# Altium project Cryo_DFFs.PrjPcb
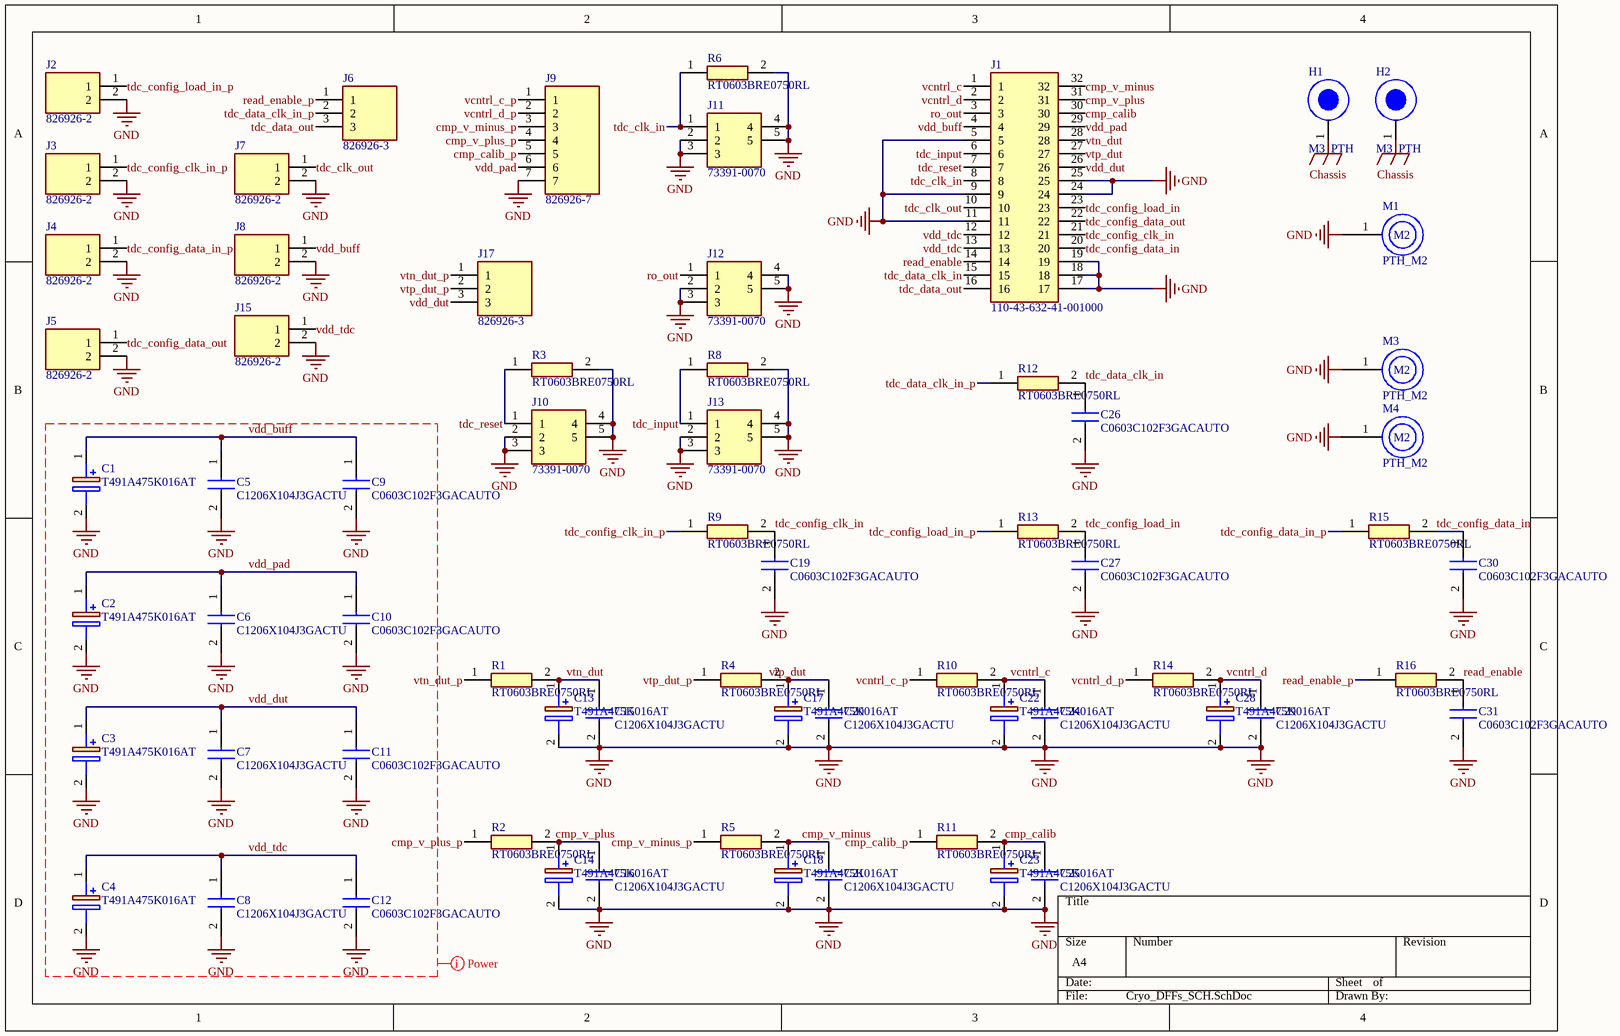
[diagram p0: Cryo_DFFs_SCH.SchDoc]
1 sheet, 66 parts. Net scope: global (net labels, ports and power ports of the same name join across sheets).
Board file: Cryo_DFFs_PCB.PcbDoc

## Sheet Cryo_DFFs_SCH.SchDoc
size A4; SheetNumber: 1; SheetTotal: 1

### Parts
C1  T491A475K016AT  [T491A]
C2  T491A475K016AT  [T491A]
C3  T491A475K016AT  [T491A]
C4  T491A475K016AT  [T491A]
C5  C1206X104J3GACTU  [C1206_FT]
C6  C1206X104J3GACTU  [C1206_FT]
C7  C1206X104J3GACTU  [C1206_FT]
C8  C1206X104J3GACTU  [C1206_FT]
C9  C0603C102F3GACAUTO  [C0603]
C10  C0603C102F3GACAUTO  [C0603]
C11  C0603C102F3GACAUTO  [C0603]
C12  C0603C102F3GACAUTO  [C0603]
C13  T491A475K016AT  [T491A]
C14  T491A475K016AT  [T491A]
C15  C1206X104J3GACTU  [C1206_FT]
C16  C1206X104J3GACTU  [C1206_FT]
C17  T491A475K016AT  [T491A]
C18  T491A475K016AT  [T491A]
C19  C0603C102F3GACAUTO  [C0603]
C20  C1206X104J3GACTU  [C1206_FT]
C21  C1206X104J3GACTU  [C1206_FT]
C22  T491A475K016AT  [T491A]
C23  T491A475K016AT  [T491A]
C24  C1206X104J3GACTU  [C1206_FT]
C25  C1206X104J3GACTU  [C1206_FT]
C26  C0603C102F3GACAUTO  [C0603]
C27  C0603C102F3GACAUTO  [C0603]
C28  T491A475K016AT  [T491A]
C29  C1206X104J3GACTU  [C1206_FT]
C30  C0603C102F3GACAUTO  [C0603]
C31  C0603C102F3GACAUTO  [C0603]
H1  M3_PTH  [M3_PTH]
H2  M3_PTH  [M3_PTH]
J1  110-43-632-41-001000  [DIPS1524W51P254L4064H419Q32N]
J2  826926-2  [HDRV2W63P0X254_1X2_508X250X970P]
J3  826926-2  [HDRV2W63P0X254_1X2_508X250X970P]
J4  826926-2  [HDRV2W63P0X254_1X2_508X250X970P]
J5  826926-2  [HDRV2W63P0X254_1X2_508X250X970P]
J6  826926-3  [HDRV3W63P0X254_1X3_762X250X950P]
J7  826926-2  [HDRV2W63P0X254_1X2_508X250X970P]
J8  826926-2  [HDRV2W63P0X254_1X2_508X250X970P]
J9  826926-7  [HDRV7W63P0X254_1X7_1778X250X970P]
J10  73391-0070  [733910070]
J11  73391-0070  [733910070]
J12  73391-0070  [733910070]
J13  73391-0070  [733910070]
J15  826926-2  [HDRV2W63P0X254_1X2_508X250X970P]
J17  826926-3  [HDRV3W63P0X254_1X3_762X250X950P]
M1  PTH_M2  [PTH_M2]
M3  PTH_M2  [PTH_M2]
M4  PTH_M2  [PTH_M2]
R1  RT0603BRE0750RL  [RESC1608X55N]
R2  RT0603BRE0750RL  [RESC1608X55N]
R3  RT0603BRE0750RL  [RESC1608X55N]
R4  RT0603BRE0750RL  [RESC1608X55N]
R5  RT0603BRE0750RL  [RESC1608X55N]
R6  RT0603BRE0750RL  [RESC1608X55N]
R8  RT0603BRE0750RL  [RESC1608X55N]
R9  RT0603BRE0750RL  [RESC1608X55N]
R10  RT0603BRE0750RL  [RESC1608X55N]
R11  RT0603BRE0750RL  [RESC1608X55N]
R12  RT0603BRE0750RL  [RESC1608X55N]
R13  RT0603BRE0750RL  [RESC1608X55N]
R14  RT0603BRE0750RL  [RESC1608X55N]
R15  RT0603BRE0750RL  [RESC1608X55N]
R16  RT0603BRE0750RL  [RESC1608X55N]

### Nets
Chassis: H1.1 H2.1
GND: C1.2(-) C2.2(-) C3.2(-) C4.2(-) C5.2 C6.2 C7.2 C8.2 C9.2 C10.2 C11.2 C12.2 C13.2(-) C14.2(-) C15.2 C16.2 C17.2(-) C18.2(-) C19.2 C20.2 C21.2 C22.2(-) C23.2(-) C24.2 C25.2 C26.2 C27.2 C28.2(-) C29.2 C30.2 C31.2 J1.5 J1.9 J1.11 J1.17 J1.18 J1.19 J1.24 J1.25 J2.2 J3.2 J4.2 J5.2 J7.2 J8.2 J9.7 J10.2 J10.3 J10.4 J10.5 J11.2 J11.3 J11.4 J11.5 J12.2 J12.3 J12.4 J12.5 J13.2 J13.3 J13.4 J13.5 J15.2 M1.1 M3.1 M4.1 R3.2 R6.2 R8.2
cmp_calib: C23.1(+) C25.1 J1.30 R11.2
cmp_calib_p: J9.5 R11.1
cmp_v_minus: C18.1(+) C21.1 J1.32 R5.2
cmp_v_minus_p: J9.3 R5.1
cmp_v_plus: C14.1(+) C16.1 J1.31 R2.2
cmp_v_plus_p: J9.4 R2.1
read_enable: C31.1 J1.14 R16.2
read_enable_p: J6.1 R16.1
ro_out: J1.3 J12.1
tdc_clk_in: J1.8 J11.1 R6.1
tdc_clk_out: J1.10 J7.1
tdc_config_clk_in: C19.1 J1.21 R9.2
tdc_config_clk_in_p: J3.1 R9.1
tdc_config_data_in: C30.1 J1.20 R15.2
tdc_config_data_in_p: J4.1 R15.1
tdc_config_data_out: J1.22 J5.1
tdc_config_load_in: C27.1 J1.23 R13.2
tdc_config_load_in_p: J2.1 R13.1
tdc_data_clk_in: C26.1 J1.15 R12.2
tdc_data_clk_in_p: J6.2 R12.1
tdc_data_out: J1.16 J6.3
tdc_input: J1.6 J13.1 R8.1
tdc_reset: J1.7 J10.1 R3.1
vcntrl_c: C22.1(+) C24.1 J1.1 R10.2
vcntrl_c_p: J9.1 R10.1
vcntrl_d: C28.1(+) C29.1 J1.2 R14.2
vcntrl_d_p: J9.2 R14.1
vdd_buff: C1.1(+) C5.1 C9.1 J1.4 J8.1
vdd_dut: C3.1(+) C7.1 C11.1 J1.26 J17.3
vdd_pad: C2.1(+) C6.1 C10.1 J1.29 J9.6
vdd_tdc: C4.1(+) C8.1 C12.1 J1.12 J1.13 J15.1
vtn_dut: C13.1(+) C15.1 J1.28 R1.2
vtn_dut_p: J17.1 R1.1
vtp_dut: C17.1(+) C20.1 J1.27 R4.2
vtp_dut_p: J17.2 R4.1

### Layout directives
net class POWER: GND, vdd_buff, vdd_dut, vdd_pad, vdd_tdc

### Notes on the sheet
- (in symbol PTH_M2) M2

### Library data of the parts
C1-C4 C13 C14 C17 C18 C22 C23 C28 = T491A475K016AT: Capacitor Polarised; Manufacturer_Name: KEMET; Datasheet Link: https://content.kemet.com/datasheets/KEM_T2005_T491.pdf; Height: 1.8mm; Manufacturer_Part_Number: T491A475K016AT; Mouser Part Number: 80-T491A475K016; Mouser Price/Stock: https://www.mouser.co.uk/ProductDetail/KEMET/T491A475K016AT?qs=Yn5jVanGvQGVW0rGsuRJZg%3D%3D; Arrow Part Number: T491A475K016AT; Arrow Price/Stock: https://www.arrow.com/en/products/t491a475k016at/kemet-corporation?region=nac
C5-C8 C15 C16 C20 C21 C24 C25 C29 = C1206X104J3GACTU: Capacitor; Manufacturer_Name: KEMET; Datasheet Link: https://content.kemet.com/datasheets/KEM_C1062_C0G_FT-CAP_SMD.pdf; Manufacturer_Part_Number: C1206X104J3GACTU; Mouser Part Number: 80-C1206X104J3G; Mouser Price/Stock: https://www.mouser.co.uk/ProductDetail/KEMET/C1206X104J3GACTU?qs=jFK2DQXLaBzaO%2FG13xKliA%3D%3D
C9-C12 C19 C26 C27 C30 C31 = C0603C102F3GACAUTO: Capacitor; Manufacturer_Name: KEMET; Datasheet Link: https://content.kemet.com/datasheets/KEM_C1022_C0G_AUTO_SMD.pdf; Height: 0.87mm; Manufacturer_Part_Number: C0603C102F3GACAUTO; Mouser Part Number: 80-C0603C102F3GAUTO; Mouser Price/Stock: https://www.mouser.co.uk/ProductDetail/KEMET/C0603C102F3GACAUTO?qs=u16ybLDytRbackJ7wfqHNA%3D%3D; Arrow Part Number: C0603C102F3GACAUTO; Arrow Price/Stock: https://www.arrow.com/en/products/c0603c102f3gacauto/kemet-corporation?region=nac
H1 H2 = M3_PTH: Plated M3 hole
J1 = 110-43-632-41-001000: Connector; Manufacturer_Name: Mill-Max; Datasheet Link: https://www.mill-max.com/products/datasheet/sockets/110-43-632-41-001000; Height: 4.191mm; Manufacturer_Part_Number: 110-43-632-41-001000; Mouser Part Number: 575-11043632; Mouser Price/Stock: https://www.mouser.co.uk/ProductDetail/Mill-Max/110-43-632-41-001000?qs=IGgAdOvCTsT571kb7t%252Bbtg%3D%3D; Arrow Part Number: 110-43-632-41-001000; Arrow Price/Stock: https://www.arrow.com/en/products/110-43-632-41-001000/mill-max
J2-J5 J7 J8 J15 = 826926-2: Connector; Manufacturer_Name: TE Connectivity; Datasheet Link: http://www.te.com/commerce/DocumentDelivery/DDEController?Action=showdoc&DocId=Customer+Drawing%7F826629%7FAB%7Fpdf%7FEnglish%7FENG_CD_826629_AB.pdf%7F826926-2; Height: 9.7mm; Manufacturer_Part_Number: 826926-2; Mouser Part Number: 571-826926-2; Mouser Price/Stock: https://www.mouser.co.uk/ProductDetail/TE-Connectivity/826926-2?qs=wMzmFFBcbXSakt8A2XXzBg%3D%3D; Arrow Part Number: 826926-2; Arrow Price/Stock: https://www.arrow.com/en/products/826926-2/te-connectivity?region=europe
J6 J17 = 826926-3: Connector; Manufacturer_Name: TE Connectivity; Datasheet Link: http://uk.rs-online.com/web/p/products/6695310; Height: 9.5mm; Manufacturer_Part_Number: 826926-3; Mouser Part Number: 571-826926-3; Mouser Price/Stock: https://www.mouser.co.uk/ProductDetail/TE-Connectivity/826926-3?qs=wMzmFFBcbXTx9otzu9%252BXNQ%3D%3D; Arrow Part Number: 826926-3; Arrow Price/Stock: https://www.arrow.com/en/products/826926-3/te-connectivity?region=europe
J9 = 826926-7: Connector; Manufacturer_Name: TE Connectivity; Datasheet Link: https://datasheet.datasheetarchive.com/originals/distributors/Datasheets_SAMA/033b7b0f3068296c60c58af5ac12145b.pdf; Height: 9.7mm; Manufacturer_Part_Number: 826926-7; Mouser Part Number: 571-826926-7; Mouser Price/Stock: https://www.mouser.co.uk/ProductDetail/TE-Connectivity/826926-7?qs=iFS2b0%2FgCMHNY6mHrLlmkw%3D%3D; Arrow Part Number: 826926-7; Arrow Price/Stock: https://www.arrow.com/en/products/826926-7/te-connectivity?region=nac
J10-J13 = 73391-0070: Connector; Manufacturer_Name: Molex; Datasheet Link: https://datasheet.datasheetarchive.com/originals/distributors/Datasheets_SAMA/cd6bf19b0e4973497e5cb3fc39017d1b.pdf; Height: 10mm; Manufacturer_Part_Number: 73391-0070; Mouser Part Number: 538-73391-0070; Mouser Price/Stock: https://www.mouser.co.uk/ProductDetail/Molex/73391-0070?qs=Vtbn2VVmZzEJo591qvlOmw%3D%3D
M1 M3 M4 = PTH_M2: PTH
R1-R6 R8-R16 = RT0603BRE0750RL: Resistor; Manufacturer_Name: KEMET; Datasheet Link: https://componentsearchengine.com/Datasheets/1/RT0603BRE0750RL.pdf; Height: 0.55mm; Manufacturer_Part_Number: RT0603BRE0750RL; Mouser Part Number: 603-RT0603BRE0750RL; Mouser Price/Stock: https://www.mouser.com/Search/Refine.aspx?Keyword=603-RT0603BRE0750RL; Arrow Part Number: RT0603BRE0750RL; Arrow Price/Stock: https://www.arrow.com/en/products/rt0603bre0750rl/yageo